# EasyEDA Pro project ProPrj_Multi-Puporse Circuit System Final_2026-03-23.epro, schematic Schematic1
Board Name: Board1; Create Date: 2026-01-26; Page Name: P1; Project Name: Multi-Puporse Circuit System Final; Schematic Name: Schematic1; Update Date: 2026-03-21; Company: EasyEDA.com; Page Size: A4; Version: V1.0
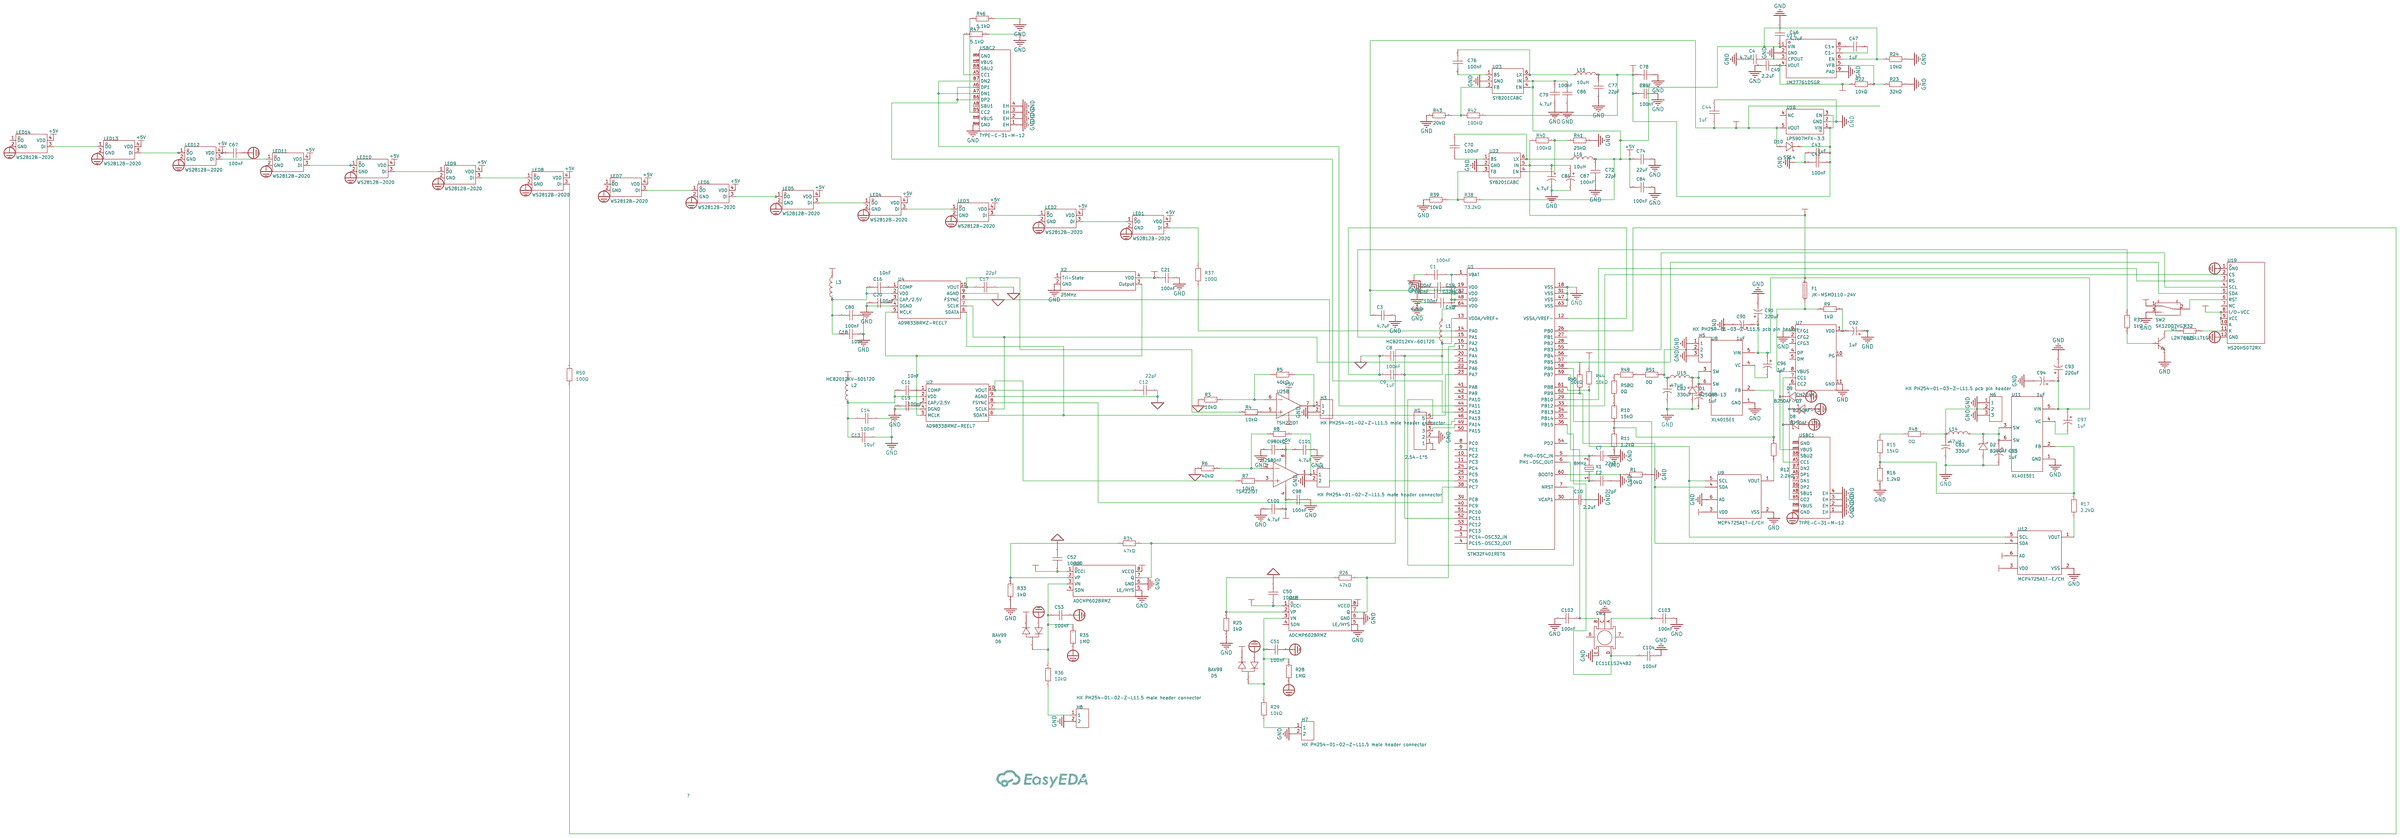
[diagram p0: schematic sheet]

## Parts
C1  100nF  [C0402]
C2  22pF  [C0603]
C3  4.7uF  [C0603]
C4  4.7uF  [C0603]
C7  22pF  [C0603]
C8  100nF  [C0402]
C9  1uF  [C0603]
C10  2.2uF  [C0603]
C11  10nF  [C0603]
C12  22pF  [C0603]
C13  10uF  [C0603]
C14  100nF  [C0402]
C15  100nF  [C0402]
C16  10nF  [C0603]
C17  22pF  [C0603]
C18  10uF  [C0603]
C19  100nF  [C0402]
C20  100nF  [C0402]
C21  100nF  [C0402]
C32MCU  100nF  [C0402]
C42  100nF  [C0402]
C43  1uF  [C0603]
C44  1uF  [C0402]
C46  4.7uF  [C0603]
C47  1uF  [C0603]
C48  100nF  [C0402]
C49  2.2uF  [C0603]
C50  100nF  [C0402]
C51  100nF  [C1206]
C52  100nF  [C0402]
C53  100nF  [C1206]
C67  100nF  [C0402]
C70  100nF  [C0402]
C72  22pF  [C0603]
C74  22uF  [C0603]
C76  100nF  [C0402]
C77  22pF  [C0603]
C78  22uF  [C0603]
C79  4.7uF  [C0603]
C80  100nF  [C0402]
C81  4.7uF  [CAP-SMD_L3.5-W2.8-FD]
C82  330uF  [CAP-TH_BD8.0-P3.50-D0.6-FD]
C83  330uF  [CAP-TH_BD8.0-P3.50-D0.6-FD]
C84  100nF  [C0402]
C85  100nF  [C0402]
C86  100nF  [C0402]
C87  100nF  [C0603]
C88  1uF  [C0603]
C90  1uF  [C0603]
C91  220uF  [CAP-TH_BD8.0-P3.50-D0.6-FD]
C92  1uF  [C0603]
C93  220uF  [CAP-TH_BD8.0-P3.50-D0.6-FD]
C94  1uF  [C0603]
C95  1uF  [C0603]
C96  1uF  [C0603]
C97  1uF  [C0603]
C98  100nF  [C0402]
C99  100nF  [C0402]
C100  4.7uF  [C0603]
C101  4.7uF  [C0603]
C102  100nF  [C0402]
C103  100nF  [C0402]
C104  100nF  [C0402]
D1  B250AF-13  [DO-214AC_L4.3-W2.7-LS5.3-RD]
D2  B250AF-13  [DO-214AC_L4.3-W2.7-LS5.3-RD]
D5  BAV99  [SOT-23-3_L2.9-W1.3-P1.90-LS2.4-BR]
D6  BAV99  [SOT-23-3_L2.9-W1.3-P1.90-LS2.4-BR]
D7  B250AF-13  [DO-214AC_L4.3-W2.7-LS5.3-RD]
D8  B250AF-13  [DO-214AC_L4.3-W2.7-LS5.3-RD]
D9  B250AF-13  [DO-214AC_L4.3-W2.7-LS5.3-RD]
D10  SS14  [SMA_L4.3-W2.6-LS5.1-RD]
F1  JK-MSMD110-24V  [F1812]
H1  2.54-1*5  [HDR-TH_5P-P2.54-V-M]
H3  HX PH254-01-02-Z-L11.5 male header connector  [HDR-TH_2P-P2.54-V-M]
H4  HX PH254-01-02-Z-L11.5 male header connector  [HDR-TH_2P-P2.54-V-M]
H5  HX PH254-01-03-Z-L11.5 pcb pin header  [HDR-TH_3P-P2.54-V-M-1]
H6  HX PH254-01-03-Z-L11.5 pcb pin header  [HDR-TH_3P-P2.54-V-M-1]
H7  HX PH254-01-02-Z-L11.5 male header connector  [HDR-TH_2P-P2.54-V-M]
H8  HX PH254-01-02-Z-L11.5 male header connector  [HDR-TH_2P-P2.54-V-M]
L1  HCB2012KV-601T20  [L0805]
L2  HCB2012KV-601T20  [L0805]
L3  HCB2012KV-601T20  [L0805]
L14  47uH  [IND-SMD_L11.0-W10.2_CXP1050]
L15  10uH  [IND-SMD_L3.0-W3.0]
L16  10uH  [IND-SMD_L3.0-W3.0]
LED1  WS2812B-2020  [LED-SMD_4P-L2.0-W2.0-TL_WS2812B-2020]
LED2  WS2812B-2020  [LED-SMD_4P-L2.0-W2.0-TL_WS2812B-2020]
LED3  WS2812B-2020  [LED-SMD_4P-L2.0-W2.0-TL_WS2812B-2020]
LED4  WS2812B-2020  [LED-SMD_4P-L2.0-W2.0-TL_WS2812B-2020]
LED5  WS2812B-2020  [LED-SMD_4P-L2.0-W2.0-TL_WS2812B-2020]
LED6  WS2812B-2020  [LED-SMD_4P-L2.0-W2.0-TL_WS2812B-2020]
LED7  WS2812B-2020  [LED-SMD_4P-L2.0-W2.0-TL_WS2812B-2020]
LED8  WS2812B-2020  [LED-SMD_4P-L2.0-W2.0-TL_WS2812B-2020]
LED9  WS2812B-2020  [LED-SMD_4P-L2.0-W2.0-TL_WS2812B-2020]
LED10  WS2812B-2020  [LED-SMD_4P-L2.0-W2.0-TL_WS2812B-2020]
LED11  WS2812B-2020  [LED-SMD_4P-L2.0-W2.0-TL_WS2812B-2020]
LED12  WS2812B-2020  [LED-SMD_4P-L2.0-W2.0-TL_WS2812B-2020]
LED13  WS2812B-2020  [LED-SMD_4P-L2.0-W2.0-TL_WS2812B-2020]
LED14  WS2812B-2020  [LED-SMD_4P-L2.0-W2.0-TL_WS2812B-2020]
Q1  L2N7002SLLT1G  [SOT-23-3_L3.0-W1.7-P0.95-LS2.9-BR]
R1  10kΩ  [R0603]
R3  10kΩ  [R0603]
R4  10kΩ  [R0603]
R5  40kΩ  [R0603]
R6  40kΩ  [R0603]
R7  10kΩ  [R0603]
R8  40kΩ  [R0603]
R9  1kΩ  [R0603]
R10  15kΩ  [R0603]
R11  1.2kΩ  [R0603]
R12  2.2kΩ  [R0603]
R15  15kΩ  [R0603]
R16  1.2kΩ  [R0603]
R17  2.2kΩ  [R0603]
R22  10kΩ  [R0603]
R23  32kΩ  [R0603]
R24  10kΩ  [R0603]
R25  1kΩ  [R0603]
R26  47kΩ  [R0603]
R28  1MΩ  [R0603]
R29  10kΩ  [R1206]
R31  1kΩ  [R0603]
R32  10Ω  [R0603]
R33  1kΩ  [R0603]
R34  47kΩ  [R0603]
R35  1MΩ  [R0603]
R36  10kΩ  [R1206]
R37  100Ω  [R0603]
R38  73.2kΩ  [R0603]
R39  10kΩ  [R0603]
R40  100kΩ  [R0402]
R41  25kΩ  [R0805]
R42  100kΩ  [R0402]
R43  20kΩ  [R0402]
R44  10kΩ  [R0603]
R45  10kΩ  [R0603]
R46  5.1kΩ  [R0402]
R47  5.1kΩ  [R0402]
R48  0Ω  [R0603]
R49  0Ω  [R0603]
R50  100Ω  [R0603]
R51  0Ω  [R0603]
R52  0Ω  [R0603]
SW1  EC11E15244B2  [SW-TH_EC11XXXXXXXX]
SW2  SK12D07VG3  [SW-TH_SK12D07VG3]
U1  STM32F401RET6  [LQFP-64_L10.0-W10.0-P0.50-LS12.0-BL]
U2  AD9833BRMZ-REEL7  [MSOP-10_L3.0-W3.0-P0.50-LS5.0-BL]
U4  AD9833BRMZ-REEL7  [MSOP-10_L3.0-W3.0-P0.50-LS5.0-BL]
U7  CH224K  [ESSOP-10_L4.9-W3.9-P1.0-LS6.0-TL-EP]
U8  XL4015E1  [TO-263-5_L10.2-W8.9-P1.70-TL]
U9  MCP4725A1T-E/CH  [SOT-23-6_L2.9-W1.6-P0.95-LS2.8-BR]
U11  XL4015E1  [TO-263-5_L10.2-W8.9-P1.70-TL]
U12  MCP4725A1T-E/CH  [SOT-23-6_L2.9-W1.6-P0.95-LS2.8-BR]
U15  47uH  [IND-SMD_L11.0-W10.2_CXP1050]
U16  LP5907MFX-3.3  [SOT-23-5_L3.0-W1.7-P0.95-LS2.8-BR]
U17  LM27761DSGR  [WSON-8_L2.0-W2.0-P0.65-BL-EP]
U18  ADCMP602BRMZ  [MSOP-8_L3.0-W3.0-P0.65-LS5.0-BL]
U19  HS20HS072RX  [OLED-SMD_HS20HS072RX]
U20  ADCMP602BRMZ  [MSOP-8_L3.0-W3.0-P0.65-LS5.0-BL]
U22  SY8201CABC  [SOT-23-6_L2.9-W1.6-P0.95-LS2.8-BR]
U23  SY8201CABC  [SOT-23-6_L2.9-W1.6-P0.95-LS2.8-BR]
U25  TSH22IDT  [SO-8_L4.9-W3.9-P1.27-LS6.0-BL]  (sections 1,2)
USBC1  TYPE-C-31-M-12  [USB-C_SMD-TYPE-C-31-M-12_1]
USBC2  TYPE-C-31-M-12  [USB-C_SMD-TYPE-C-31-M-12_1]
X1  8MHz  [CRYSTAL-TH_L11.1-W4.7]
X2  25MHz  [OSC-SMD_4P-L3.2-W2.5-BL-OXETDLJANF-0.032768MHZ]

## Library data of the parts
C1 C8 C14 C15 C19-C21 C32MCU C42 C48 C50 C52 C67 C70 C76 C80 C84-C86 C98 C99 C102-C104 = CC0402KRX7R7BB104: Capacitance: Tolerance:±10% Tolerance:±10% Voltage Rated: Temperature Coefficient:; LCSC Part Name: 100nF ±10% 16V; Supplier Part: C60474; Manufacturer: YAGEO(国巨); Supplier Footprint: 0402; JLCPCB Part Class: Extended Part; Datasheet: https://atta.szlcsc.com/upload/public/pdf/source/20211223/9278FD768280B81DDBEF48FA36411A03.pdf; Supplier: LCSC; Tolerance: ±10%
C2 C7 C12 C17 C72 C77 = CC0603JRNPO9BN220: Capacitance:22pF Tolerance:±5% Tolerance:±5% Voltage Rating:50V Temperature Coefficient:NP0; LCSC Part Name: 22pF ±5% 50V; Supplier Part: C105620; Manufacturer: YAGEO(国巨); Supplier Footprint: 0603; JLCPCB Part Class: Extended Part; Datasheet: https://item.szlcsc.com/datasheet/CC0603JRNPO9BN220/106835.html; Supplier: LCSC; Tolerance: ±5%; Voltage Rating: 50V; Temperature Coefficient: NP0
C3 C4 C46 C79 C100 C101 = CL10A475KP8NNNC: Capacitance:4.7uF Tolerance:±10% Tolerance:±10% Voltage Rating:10V Temperature Coefficient:X5R; LCSC Part Name: 4.7uF ±10% 10V; Supplier Part: C1705; Manufacturer: SAMSUNG(三星); Supplier Footprint: 0603; JLCPCB Part Class: Extended Part; Datasheet: https://item.szlcsc.com/datasheet/CL10A475KP8NNNC/2057.html; Supplier: LCSC; Tolerance: ±10%; Voltage Rating: 10V; Temperature Coefficient: X5R
C9 C43 C47 = CL10B105KB8NQNC: Capacitance:1uF Tolerance:±10% Tolerance:±10% Voltage Rating:50V Temperature Coefficient:X7R; LCSC Part Name: 1uF ±10% 50V; Supplier Part: C5199872; Manufacturer: SAMSUNG(三星); Supplier Footprint: 0603; JLCPCB Part Class: Extended Part; Datasheet: https://item.szlcsc.com/datasheet/CL10B105KB8NQNC/5885909.html; Supplier: LCSC; Tolerance: ±10%; Voltage Rating: 50V; Temperature Coefficient: X7R
C10 C49 = CL10A225KO8NNNC: Capacitance:2.2uF Tolerance:±10% Tolerance:±10% Voltage Rating:16V Temperature Coefficient:X5R; LCSC Part Name: 2.2uF ±10% 16V; Supplier Part: C23630; Manufacturer: SAMSUNG(三星); Supplier Footprint: 0603; JLCPCB Part Class: Basic Part; Datasheet: https://item.szlcsc.com/datasheet/CL10A225KO8NNNC/24366.html; Supplier: LCSC; Tolerance: ±10%; Voltage Rating: 16V; Temperature Coefficient: X5R
C11 C16 = FCC0603B103K500CT: Capacitance:10nF Tolerance:±10% Tolerance:±10% Voltage Rating:50V Temperature Coefficient:X7R; LCSC Part Name: 10nF ±10% 50V; Supplier Part: C5137477; Manufacturer: FOJAN(富捷); Supplier Footprint: 0603; JLCPCB Part Class: Extended Part; Datasheet: https://item.szlcsc.com/datasheet/FCC0603B103K500CT/5746979.html; Supplier: LCSC; Tolerance: ±10%; Voltage Rating: 50V; Temperature Coefficient: X7R
C13 C18 = CL10A106MQ8NNNC: Capacitance:10uF Tolerance:±20% Tolerance:±20% Voltage Rating:6.3V Temperature Coefficient:X5R; LCSC Part Name: 10uF ±20% 6.3V; Supplier Part: C1691; Manufacturer: SAMSUNG(三星); Supplier Footprint: 0603; JLCPCB Part Class: Extended Part; Datasheet: https://item.szlcsc.com/datasheet/CL10A106MQ8NNNC/2043.html; Supplier: LCSC; Tolerance: ±20%; Voltage Rating: 6.3V; Temperature Coefficient: X5R
C44 = V105K0402X7R6R3NNT: Capacitance:1uF Voltage Rating:6.3V Temperature Coefficient:X7R; LCSC Part Name: 1uF 6.3V; Supplier Part: C5240378; Manufacturer: VIIYONG(微容); Supplier Footprint: 0402; JLCPCB Part Class: Extended Part; Datasheet: https://item.szlcsc.com/datasheet/V105K0402X7R6R3NNT/5944237.html; Supplier: LCSC; Voltage Rating: 6.3V; Temperature Coefficient: X7R
C51 C53 = CGA1206M3L104J101MT: Capacitance:100nF Tolerance:±5% Tolerance:±5% Voltage Rating:100V Temperature Coefficient:-; LCSC Part Name: 100nF ±5% 100V; Supplier Part: C22440581; Manufacturer: HRE(芯声); Supplier Footprint: 1206; JLCPCB Part Class: Extended Part; Datasheet: https://item.szlcsc.com/datasheet/CGA1206M3L104J101MT/24087515.html; Supplier: LCSC; Tolerance: ±5%; Voltage Rating: 100V
C74 C78 = CL10A226MQ8NRNC: Capacitance:22uF Tolerance:±20% Tolerance:±20% Voltage Rating:6.3V Temperature Coefficient:X5R; LCSC Part Name: 22uF ±20% 6.3V; Supplier Part: C59461; Manufacturer: SAMSUNG(三星); Supplier Footprint: 0603; JLCPCB Part Class: Basic Part; Datasheet: https://item.szlcsc.com/datasheet/CL10A226MQ8NRNC/60514.html; Supplier: LCSC; Tolerance: ±20%; Voltage Rating: 6.3V; Temperature Coefficient: X5R
C81 = CA45-B-35V-4.7UF-K: Capacitance:4.7uF Tolerance:±10% Tolerance:±10% Voltage Rating:35V Current - Leakage:1.6uA Ripple Current:- Equivalent Series Resistance(ESR):- Operating Temperature:-55℃~+125℃ Operating Temperature:-55℃~+125℃; LCSC Part Name: 4.7uF ±10% 35V; Supplier Part: C2764875; Manufacturer: CEC(振华新云); Supplier Footprint: CASE-B-3528-19(mm); JLCPCB Part Class: Extended Part; Datasheet: https://item.szlcsc.com/datasheet/CA45-B-35V-4.7UF-K/2899509.html; Supplier: LCSC; Tolerance: ±10%; Voltage Rating: 35V; Current - Leakage: 1.6uA; Operating Temperature: -55℃~+125℃
C82 C83 = ERS1EM331F12OT: Capacitance: Tolerance:±20% Tolerance:±20% Rated Voltage: Lead Spacing: φD: L: Lifetime @ Temp:7000hrs@105℃; LCSC Part Name: 330uF ±20% 25V; Supplier Part: C383041; Manufacturer: AISHI(艾华集团); Supplier Footprint: 插件,D8xL12mm; JLCPCB Part Class: Extended Part; Datasheet: https://atta.szlcsc.com/upload/public/pdf/source/20191015/C438940_4B8E60A742BB0AE40DDEF87A5C89089D.pdf; Supplier: LCSC; Tolerance: ±20%; Lifetime @ Temp: 7000hrs@105℃
C87 = CC0603KRX7R9BB104: Capacitance:100nF Tolerance:±10% Tolerance:±10% Voltage Rating:50V Temperature Coefficient:X7R; LCSC Part Name: 100nF ±10% 50V; Supplier Part: C14663; Manufacturer: YAGEO(国巨); Supplier Footprint: 0603; JLCPCB Part Class: Basic Part; Datasheet: https://item.szlcsc.com/datasheet/CC0603KRX7R9BB104/15331.html; Supplier: LCSC; Tolerance: ±10%; Voltage Rating: 50V; Temperature Coefficient: X7R
C88 C90 C92 C94-C97 = CL10B105KA8NNNC: Capacitance:1uF Tolerance:±10% Tolerance:±10% Voltage Rating:25V Temperature Coefficient:X7R; LCSC Part Name: 1uF ±10% 25V; Supplier Part: C29936; Manufacturer: SAMSUNG(三星); Supplier Footprint: 0603; JLCPCB Part Class: Extended Part; Datasheet: https://item.szlcsc.com/datasheet/CL10B105KA8NNNC/30690.html; Supplier: LCSC; Tolerance: ±10%; Voltage Rating: 25V; Temperature Coefficient: X7R
C91 C93 = ERS1EM221F12OT: Capacitance:220uF Tolerance:±20% Tolerance:±20% Voltage Rating:25V Pin Spacing:3.5mm Diameter:8mm Height - Seated (Max):12mm Lifetime:7000hrs@105℃; LCSC Part Name: 220uF ±20% 25V; Supplier Part: C160162; Manufacturer: AISHI(艾华集团); Supplier Footprint: 插件,D8xL12mm; JLCPCB Part Class: Extended Part; Datasheet: https://atta.szlcsc.com/upload/public/pdf/source/20191015/C438940_4B8E60A742BB0AE40DDEF87A5C89089D.pdf; Supplier: LCSC; Tolerance: ±20%; Voltage Rating: 25V; Pin Spacing: 3.5mm; Diameter: 8mm; Height - Seated (Max): 12mm; Lifetime: 7000hrs@105℃
D1 D2 D7-D9 = B250AF-13: LCSC Part Name: 2A肖特基势垒整流器; Supplier Part: C17389395; Manufacturer: DIODES(美台); Supplier Footprint: DO-214AC; JLCPCB Part Class: Extended Part; Datasheet: https://item.szlcsc.com/datasheet/B250AF-13/18518568.html; Supplier: LCSC
D5 D6 = BAV99_C51898307: Supplier Part: C51898307; Manufacturer: baocheng(宝乘); Supplier Footprint: SOT-23; JLCPCB Part Class: Extended Part; Datasheet: https://item.szlcsc.com/datasheet/BAV99/54583732.html; Supplier: LCSC
D10 = SS14_C5155166: Voltage - Forward(Vf@If):550mV@1A Voltage - DC Reverse(Vr):40V Current - Rectified:1A Reverse Leakage Current (Ir):500uA Operating Junction Temperature Range:-65℃~+150℃ Operating Junction Temperature Range:-65℃~+150℃ Non-Repetitive Peak Forward Surge Curr; LCSC Part Name: 电压:40V 电流:1A; Supplier Part: C5155166; Manufacturer: SUNMATE(森美特); Supplier Footprint: SMA(DO-214AC); JLCPCB Part Class: Extended Part; Datasheet: https://item.szlcsc.com/datasheet/SS14/5783804.html; Supplier: LCSC; Voltage - Forward(Vf@If): 550mV@1A; Voltage - DC Reverse(Vr): 40V; Current - Rectified: 1A; Reverse Leakage Current (Ir): 500uA; Operating Junction Temperature Range: -65℃~+150℃; Non-Repetitive Peak Forward Surge Current: 40A
F1 = JK-MSMD110-24V: Voltage - Max:24V Current - Max:100A Hold Current:1.1A Trip Current:2.2A Resistance - Initial (Ri) (Min):50mΩ Resistance - Post Trip (R1) (Max):250mΩ Time to Trip(Max):300ms Operating Temperature:-40℃~+85℃ Operating Temperature:-40℃~+85℃ Length:4.73mm Wid; LCSC Part Name: 24V 1.1A 1812自恢复; Supplier Part: C369172; Manufacturer: JK(金科); Supplier Footprint: 1812; JLCPCB Part Class: Extended Part; Datasheet: https://item.szlcsc.com/datasheet/JK-MSMD110-24V/343085.html; Supplier: LCSC; Voltage - Max: 24V; Current - Max: 100A; Hold Current: 1.1A; Trip Current: 2.2A; Resistance - Initial (Ri) (Min): 50mΩ; Resistance - Post Trip (R1) (Max): 250mΩ; Time to Trip(Max): 300ms; Operating Temperature: -40℃~+85℃; Length: 4.73mm; Width: 3.41mm; Height: 1.3mm
H1 = 2.54-1*5: Pin Structure:1x5P Pitch:2.54mm Circluar Pins/Square Pins:Pin Header Mounting Type:Through Hole Number of Rows:1 Number of Pins:5P Current Rating:2.5A Length of Mating Pin:6mm Insulation Height:2.54mm Length of End Connection Pin:3mm Contact Material:Bras; LCSC Part Name: 1x5P 间距:2.54mm 方针 直插; Supplier Part: C5156614; Manufacturer: ZHOURI(洲日); Supplier Footprint: 插件,P=2.54mm; JLCPCB Part Class: Extended Part; Datasheet: https://item.szlcsc.com/datasheet/2.54-1*5/5790714.html; Supplier: LCSC; Pin Structure: 1x5P; Pitch: 2.54mm; Circluar Pins/Square Pins: Pin Header; Mounting Type: Through Hole; Number of Rows: 1; Number of Pins: 5P; Current Rating: 2.5A; Length of Mating Pin: 6mm; Insulation Height: 2.54mm; Length of End Connection Pin: 3mm; Contact Material: Brass; Contact Plating: Gold; Operating Temperature: -40℃~+105℃
H3 H4 H7 H8 = HX PH254-01-02-Z-L11.5 male header connector: Pin Structure:1x2P Pitch:2.54mm Circluar Pins/Square Pins:Pin Header Mounting Type:Through Hole Number of Rows:1 Number of Pins:2P Current Rating:3A Voltage Rating (Max):1kV Length of Mating Pin:6mm Insulation Height:2.5mm Length of End Connection Pin:3mm; LCSC Part Name: 1x2P 间距:2.54mm 方针 直插; Supplier Part: C52016390; Manufacturer: hanxia(韩下); Supplier Footprint: 插件,P=2.54mm; JLCPCB Part Class: Extended Part; Datasheet: https://item.szlcsc.com/datasheet/HX%2520PH254-01-02-Z-L11.5%2520male%2520header%2520connector/54760435.html; Supplier: LCSC; Pin Structure: 1x2P; Pitch: 2.54mm; Circluar Pins/Square Pins: Pin Header; Mounting Type: Through Hole; Number of Rows: 1; Number of Pins: 2P; Current Rating: 3A; Voltage Rating (Max): 1kV; Length of Mating Pin: 6mm; Insulation Height: 2.5mm; Length of End Connection Pin: 3mm; Contact Material: Brass; Contact Plating: Gold; Operating Temperature: -40℃~+105℃
H5 H6 = HX PH254-01-03-Z-L11.5 pcb pin header: Pin Structure:1x3P Pitch:2.54mm Circluar Pins/Square Pins:Pin Header Mounting Type:Through Hole Number of Rows:1 Number of Pins:3P Current Rating:3A Voltage Rating (Max):1kV Length of Mating Pin:6mm Insulation Height:2.5mm Length of End Connection Pin:3mm; LCSC Part Name: 1x3P 间距:2.54mm 方针 直插; Supplier Part: C52016391; Manufacturer: hanxia(韩下); Supplier Footprint: 插件,P=2.54mm; JLCPCB Part Class: Extended Part; Datasheet: https://item.szlcsc.com/datasheet/HX%2520PH254-01-03-Z-L11.5%2520pcb%2520pin%2520header/54760436.html; Supplier: LCSC; Pin Structure: 1x3P; Pitch: 2.54mm; Circluar Pins/Square Pins: Pin Header; Mounting Type: Through Hole; Number of Rows: 1; Number of Pins: 3P; Current Rating: 3A; Voltage Rating (Max): 1kV; Length of Mating Pin: 6mm; Insulation Height: 2.5mm; Length of End Connection Pin: 3mm; Contact Material: Brass; Contact Plating: Gold; Operating Temperature: -40℃~+105℃
L1-L3 = HCB2012KV-601T20: Impedance @ Frequency:600Ω Tolerance:±25% Tolerance:±25%; LCSC Part Name: 车载品-2mm*1.2mm-600?-±25%; Supplier Part: C5139902; Manufacturer: TAI-TECH(台庆); Supplier Footprint: 0805; JLCPCB Part Class: Extended Part; Supplier: LCSC; Impedance @ Frequency: 600Ω; Tolerance: ±25%
L14 U15 = CXP1050-470M-AG(47uh): Inductance:47uH Tolerance:±20% Tolerance:±20% Saturation Current (Isat):5A Type:Integrated molded inductor; LCSC Part Name: 47uH ±20% 5A; Supplier Part: C7187330; Manufacturer: DMBJ(振宝佳); Supplier Footprint: SMD,10.2x11mm; JLCPCB Part Class: Extended Part; Datasheet: https://atta.szlcsc.com/upload/public/pdf/source/20230710/CFC2BBD551035D908F0C7CBC8304138F.pdf; Supplier: LCSC; Tolerance: ±20%; Saturation Current (Isat): 5A; Type: Integrated molded inductor
L15 L16 = ZET-CORE-303012DT100MBCA: Inductance:10uH Tolerance:±20% Tolerance:±20% Current Rating:2.5A Current - Saturation(Isat):2.5A DC Resistance(DCR):192mΩ Type:Molded Inductor; LCSC Part Name: 10uH ±20% 2.5A; Supplier Part: C49009156; Manufacturer: ZE(增益); Supplier Footprint: SMD,3x3mm; JLCPCB Part Class: Extended Part; Datasheet: https://item.szlcsc.com/datasheet/ZET-CORE-303012DT100MBCA/51362276.html; Supplier: LCSC; Tolerance: ±20%; Current Rating: 2.5A; Current - Saturation(Isat): 2.5A; DC Resistance(DCR): 192mΩ; Type: Molded Inductor
LED1-LED14 = WS2812B-2020: Wavelength:515.6nm；622.5nm；470.4nm Luminous Intensity:200mcd；160mcd；520mcd Fixed-Frequency Pwm Mode:- Data Transmission Rate:100KB/S Voltage - Supply:5V Voltage - Supply:5V Quiescent Current:- Lens Color:- ESD Withstand Voltage:- Installation method:op Vi; LCSC Part Name: RGB三色; Supplier Part: C965555; Manufacturer: worldsemi; Supplier Footprint: SMD,2.2x2mm; JLCPCB Part Class: Extended Part; Datasheet: https://item.szlcsc.com/datasheet/WS2812B-2020/1051115.html; Supplier: LCSC; Wavelength: 515.6nm；622.5nm；470.4nm; Luminous Intensity: 200mcd；160mcd；520mcd; Data Transmission Rate: 100KB/S; Voltage - Supply: 5V; Installation method: op View Mount
Q1 = L2N7002SLLT1G: Type:1 N-channel Drain to Source Voltage:60V Current - Continuous Drain(Id): RDS(on):2.8Ω@10V,500mA Pd - Power Dissipation:300mW Gate Threshold Voltage (Vgs(th)@Id):- Gate Charge(Qg):440pC@4.5V Input Capacitance(Ciss@Vds):35pF@25V Reverse Transfer Capacit; LCSC Part Name: 1个N沟道 耐压:60V 电流:380mA; Supplier Part: C22446827; Manufacturer: LRC(乐山无线电); Supplier Footprint: SOT-23; JLCPCB Part Class: Extended Part; Datasheet: https://atta.szlcsc.com/upload/public/pdf/source/20240529/804683F6F610BC810C43B61F364F3FCA.pdf; Supplier: LCSC; Type: 1 N-channel; Drain to Source Voltage: 60V; RDS(on): 2.8Ω@10V,500mA; Pd - Power Dissipation: 300mW; Gate Charge(Qg): 440pC@4.5V; Input Capacitance(Ciss@Vds): 35pF@25V; Operating Temperature: -55℃~+150℃
R1 R3 R4 R7 R22 R24 R39 R44 R45 = RC0603FR-0710KL: Type:Thick Film Resistors Resistance: Tolerance:±1% Tolerance:±1% Power(Watts): Overload Voltage (Max): Temperature Coefficient:±100ppm/℃ Temperature Coefficient:±100ppm/℃ Operating Temperature Range:-55℃~+155℃ Operating Temperature Range:-55℃~+155℃; LCSC Part Name: 厚膜电阻 10kΩ ±1% 100mW; Supplier Part: C98220; Manufacturer: YAGEO(国巨); Supplier Footprint: 0603; JLCPCB Part Class: Extended Part; Datasheet: https://atta.szlcsc.com/upload/public/pdf/source/20180927/C295883_E8D83085EA81BD7DE0B2B681138C15EE.pdf; Supplier: LCSC; Type: Thick Film Resistors; Tolerance: ±1%; Temperature Coefficient: ±100ppm/℃; Operating Temperature Range: -55℃~+155℃
R5 R6 R8 = SCR0603F40K: Type:Thick Film Resistors Resistance: Tolerance:±1% Tolerance:±1% Power(Watts): Overload Voltage (Max): Operating Temperature Range:-55℃~+155℃ Operating Temperature Range:-55℃~+155℃; LCSC Part Name: 40kΩ ±1%; Supplier Part: C3016445; Manufacturer: VO(翔胜); Supplier Footprint: 0603; JLCPCB Part Class: Extended Part; Datasheet: https://atta.szlcsc.com/upload/public/pdf/source/20220513/247AF9639BA21CF93567DC289CCC6A22.pdf; Supplier: LCSC; Type: Thick Film Resistors; Tolerance: ±1%; Operating Temperature Range: -55℃~+155℃
R9 R25 R31 R33 = 0603WAF1001T5E: Type:Thick Film Resistor Resistance:1kΩ Tolerance:±1% Tolerance:±1% Power(Watts):100mW Voltage-Supply(Max):75V Temperature Coefficient:±100ppm/℃ Temperature Coefficient:±100ppm/℃ Operating Temperature:-55℃~+155℃ Operating Temperature:-55℃~+155℃; LCSC Part Name: 1kΩ ±1% 100mW 厚膜电阻; Supplier Part: C21190; Manufacturer: UNI-ROYAL(厚声); Supplier Footprint: 0603; JLCPCB Part Class: Basic Part; Datasheet: https://item.szlcsc.com/datasheet/0603WAF1001T5E/21904.html; Supplier: LCSC; Type: Thick Film Resistor; Tolerance: ±1%; Power(Watts): 100mW; Voltage-Supply(Max): 75V; Temperature Coefficient: ±100ppm/℃; Operating Temperature: -55℃~+155℃
R10 R15 = 0603WAF1502T5E: Type:Thick Film Resistor Resistance:15kΩ Tolerance:±1% Tolerance:±1% Power(Watts):100mW Voltage-Supply(Max):75V Temperature Coefficient:±100ppm/℃ Temperature Coefficient:±100ppm/℃ Operating Temperature:-55℃~+155℃ Operating Temperature:-55℃~+155℃; LCSC Part Name: 15kΩ ±1% 100mW 厚膜电阻; Supplier Part: C22809; Manufacturer: UNI-ROYAL(厚声); Supplier Footprint: 0603; JLCPCB Part Class: Basic Part; Datasheet: https://item.szlcsc.com/datasheet/0603WAF1502T5E/23536.html; Supplier: LCSC; Type: Thick Film Resistor; Tolerance: ±1%; Power(Watts): 100mW; Voltage-Supply(Max): 75V; Temperature Coefficient: ±100ppm/℃; Operating Temperature: -55℃~+155℃
R11 R16 = 0603WAF1201T5E: Type:Thick Film Resistor Resistance:1.2kΩ Tolerance:±1% Tolerance:±1% Power(Watts):100mW Voltage-Supply(Max):75V Temperature Coefficient:±100ppm/℃ Temperature Coefficient:±100ppm/℃ Operating Temperature:-55℃~+155℃ Operating Temperature:-55℃~+155℃; LCSC Part Name: 1.2kΩ ±1% 100mW 厚膜电阻; Supplier Part: C22765; Manufacturer: UNI-ROYAL(厚声); Supplier Footprint: 0603; JLCPCB Part Class: Basic Part; Datasheet: https://item.szlcsc.com/datasheet/0603WAF1201T5E/23492.html; Supplier: LCSC; Type: Thick Film Resistor; Tolerance: ±1%; Power(Watts): 100mW; Voltage-Supply(Max): 75V; Temperature Coefficient: ±100ppm/℃; Operating Temperature: -55℃~+155℃
R12 R17 = 0603WAF2201T5E_C4190: Type:Thick Film Resistors Resistance:2.2kΩ Tolerance:±1% Tolerance:±1% Power(Watts): Overload Voltage (Max): Temperature Coefficient:±100ppm/℃ Temperature Coefficient:±100ppm/℃ Operating Temperature Range:-55℃~+155℃ Operating Temperature Range:-55℃~+155℃; LCSC Part Name: 2.2kΩ ±1% 100mW 厚膜电阻; Supplier Part: C4190; Manufacturer: UNI-ROYAL(厚声); Manufacturer Part: 0603WAF2201T5E; Supplier Footprint: 0603; JLCPCB Part Class: Basic Part; Datasheet: https://atta.szlcsc.com/upload/public/pdf/source/20200306/C422600_1E6D84923E4A46A82E41ADD87F860B5C.pdf; Supplier: LCSC; Type: Thick Film Resistors; Tolerance: ±1%; Temperature Coefficient: ±100ppm/℃; Operating Temperature Range: -55℃~+155℃
R23 = AR03BTC3202: Resistance:32kΩ Tolerance:±0.1% Tolerance:±0.1% Power(Watts):62.5mW Temperature Coefficient:±25ppm/℃ Temperature Coefficient:±25ppm/℃; LCSC Part Name: 32kΩ ±0.1% 62.5mW; Supplier Part: C304066; Manufacturer: Viking(光颉); Supplier Footprint: 0603; JLCPCB Part Class: Extended Part; Datasheet: https://item.szlcsc.com/datasheet/AR03BTC3202/288133.html; Supplier: LCSC; Tolerance: ±0.1%; Power(Watts): 62.5mW; Temperature Coefficient: ±25ppm/℃
R26 R34 = 0603WAF4702T5E: Type:Thick Film Resistor Resistance:47kΩ Tolerance:±1% Tolerance:±1% Power(Watts):100mW Voltage-Supply(Max):75V Temperature Coefficient:±100ppm/℃ Temperature Coefficient:±100ppm/℃ Operating Temperature:-55℃~+155℃ Operating Temperature:-55℃~+155℃; LCSC Part Name: 47kΩ ±1% 100mW 厚膜电阻; Supplier Part: C25819; Manufacturer: UNI-ROYAL(厚声); Supplier Footprint: 0603; JLCPCB Part Class: Basic Part; Datasheet: https://item.szlcsc.com/datasheet/0603WAF4702T5E/26562.html; Supplier: LCSC; Type: Thick Film Resistor; Tolerance: ±1%; Power(Watts): 100mW; Voltage-Supply(Max): 75V; Temperature Coefficient: ±100ppm/℃; Operating Temperature: -55℃~+155℃
R28 R35 = 0603WAF1004T5E: Type:Thick Film Resistors Resistance:1MΩ Tolerance:±1% Tolerance:±1% Power(Watts): Overload Voltage (Max): Temperature Coefficient:±100ppm/℃ Temperature Coefficient:±100ppm/℃ Operating Temperature Range:-55℃~+155℃ Operating Temperature Range:-55℃~+155℃; LCSC Part Name: 1MΩ ±1% 100mW 厚膜电阻; Supplier Part: C22935; Manufacturer: UNI-ROYAL(厚声); Supplier Footprint: 0603; JLCPCB Part Class: Basic Part; Datasheet: https://atta.szlcsc.com/upload/public/pdf/source/20200306/C422600_1E6D84923E4A46A82E41ADD87F860B5C.pdf; Supplier: LCSC; Type: Thick Film Resistors; Tolerance: ±1%; Temperature Coefficient: ±100ppm/℃; Operating Temperature Range: -55℃~+155℃
R29 R36 = 1206W4F1002T5E: Type:Thick Film Resistor Resistance:10kΩ Tolerance:±1% Tolerance:±1% Power(Watts):250mW Voltage-Supply(Max):200V Temperature Coefficient:±100ppm/℃ Temperature Coefficient:±100ppm/℃ Operating Temperature:-55℃~+155℃ Operating Temperature:-55℃~+155℃; LCSC Part Name: 10kΩ ±1% 250mW 厚膜电阻; Supplier Part: C17902; Manufacturer: UNI-ROYAL(厚声); Supplier Footprint: 1206; JLCPCB Part Class: Basic Part; Datasheet: https://item.szlcsc.com/datasheet/1206W4F1002T5E/18590.html; Supplier: LCSC; Type: Thick Film Resistor; Tolerance: ±1%; Power(Watts): 250mW; Voltage-Supply(Max): 200V; Temperature Coefficient: ±100ppm/℃; Operating Temperature: -55℃~+155℃
R32 = 0603WAF100JT5E: Type:Thick Film Resistor Resistance:10Ω Tolerance:±1% Tolerance:±1% Power(Watts):100mW Voltage-Supply(Max):75V Temperature Coefficient:±400ppm/℃ Temperature Coefficient:±400ppm/℃ Operating Temperature:-55℃~+155℃ Operating Temperature:-55℃~+155℃; LCSC Part Name: 10Ω ±1% 100mW 厚膜电阻; Supplier Part: C22859; Manufacturer: UNI-ROYAL(厚声); Supplier Footprint: 0603; JLCPCB Part Class: Basic Part; Datasheet: https://item.szlcsc.com/datasheet/0603WAF100JT5E/23586.html; Supplier: LCSC; Type: Thick Film Resistor; Tolerance: ±1%; Power(Watts): 100mW; Voltage-Supply(Max): 75V; Temperature Coefficient: ±400ppm/℃; Operating Temperature: -55℃~+155℃
R37 R50 = FRC0603J101 TS: Type:Thick Film Resistor Resistance:100Ω Tolerance:±5% Tolerance:±5% Power(Watts):100mW Voltage-Supply(Max):75V Temperature Coefficient:±100ppm/℃ Temperature Coefficient:±100ppm/℃ Operating Temperature:-55℃~+155℃ Operating Temperature:-55℃~+155℃; LCSC Part Name: 100Ω ±5% 100mW 厚膜电阻; Supplier Part: C2907089; Manufacturer: FOJAN(富捷); Supplier Footprint: 0603; JLCPCB Part Class: Extended Part; Supplier: LCSC; Type: Thick Film Resistor; Tolerance: ±5%; Power(Watts): 100mW; Voltage-Supply(Max): 75V; Temperature Coefficient: ±100ppm/℃; Operating Temperature: -55℃~+155℃
R38 = RS-03K7322FT: Type:Thick Film Resistors Resistance:73.2kΩ Tolerance:±1% Tolerance:±1% Power(Watts): Overload Voltage (Max): Temperature Coefficient:±100ppm/℃ Temperature Coefficient:±100ppm/℃ Operating Temperature Range:-55℃~+155℃ Operating Temperature Range:-55℃~+155℃; LCSC Part Name: 厚膜电阻 73.2kΩ ±1% 100mW; Supplier Part: C321992; Manufacturer: FH(风华); Supplier Footprint: 0603; JLCPCB Part Class: Extended Part; Datasheet: https://atta.szlcsc.com/upload/public/pdf/source/20190505/C118335_36085569433BA7FFC796E569DBFE3139.pdf; Supplier: LCSC; Type: Thick Film Resistors; Tolerance: ±1%; Temperature Coefficient: ±100ppm/℃; Operating Temperature Range: -55℃~+155℃
R40 R42 = RC0402FR-07100KL: Type:Thick Film Resistor Resistance:100kΩ Tolerance:±1% Tolerance:±1% Power(Watts):62.5mW Voltage-Supply(Max):50V Temperature Coefficient:±100ppm/℃ Temperature Coefficient:±100ppm/℃ Operating Temperature:-55℃~+155℃ Operating Temperature:-55℃~+155℃; LCSC Part Name: 厚膜电阻 100kΩ ±1% 62.5mW; Supplier Part: C60491; Manufacturer: YAGEO(国巨); Supplier Footprint: 0402; JLCPCB Part Class: Extended Part; Datasheet: https://item.szlcsc.com/datasheet/RC0402FR-07100KL/61543.html; Supplier: LCSC; Type: Thick Film Resistor; Tolerance: ±1%; Power(Watts): 62.5mW; Voltage-Supply(Max): 50V; Temperature Coefficient: ±100ppm/℃; Operating Temperature: -55℃~+155℃
R41 = ARG05DTC2502: Type:Thin Film Resistor Resistance:25kΩ Tolerance:±0.5% Tolerance:±0.5% Power(Watts):125mW Voltage-Supply(Max):150V Temperature Coefficient:±25ppm/℃ Temperature Coefficient:±25ppm/℃ Operating Temperature:-55℃~+155℃ Operating Temperature:-55℃~+155℃; LCSC Part Name: 薄膜电阻 25kΩ ±0.5% 125mW; Supplier Part: C2828838; Manufacturer: Viking(光颉); Supplier Footprint: 0805; JLCPCB Part Class: Extended Part; Datasheet: https://item.szlcsc.com/datasheet/ARG05DTC2502/2977307.html; Supplier: LCSC; Type: Thin Film Resistor; Tolerance: ±0.5%; Power(Watts): 125mW; Voltage-Supply(Max): 150V; Temperature Coefficient: ±25ppm/℃; Operating Temperature: -55℃~+155℃
R43 = RC0402FR-0720KL: Type:Thick Film Resistor Resistance:20kΩ Tolerance:±1% Tolerance:±1% Power(Watts):62.5mW Voltage-Supply(Max):50V Temperature Coefficient:±100ppm/℃ Temperature Coefficient:±100ppm/℃ Operating Temperature:-55℃~+155℃ Operating Temperature:-55℃~+155℃; LCSC Part Name: 厚膜电阻 20kΩ ±1% 62.5mW; Supplier Part: C93942; Manufacturer: YAGEO(国巨); Supplier Footprint: 0402; JLCPCB Part Class: Extended Part; Datasheet: https://item.szlcsc.com/datasheet/RC0402FR-0720KL/95140.html; Supplier: LCSC; Type: Thick Film Resistor; Tolerance: ±1%; Power(Watts): 62.5mW; Voltage-Supply(Max): 50V; Temperature Coefficient: ±100ppm/℃; Operating Temperature: -55℃~+155℃
R46 R47 = FRC0402F5101TS: Type:Thick Film Resistor Resistance:5.1kΩ Tolerance:±1% Tolerance:±1% Power(Watts):62.5mW Voltage-Supply(Max):50V Temperature Coefficient:±100ppm/℃ Temperature Coefficient:±100ppm/℃ Operating Temperature:-55℃~+155℃ Operating Temperature:-55℃~+155℃; LCSC Part Name: 5.1kΩ ±1% 62.5mW 厚膜电阻; Supplier Part: C2906874; Manufacturer: FOJAN(富捷); Supplier Footprint: 0402; JLCPCB Part Class: Extended Part; Supplier: LCSC; Type: Thick Film Resistor; Tolerance: ±1%; Power(Watts): 62.5mW; Voltage-Supply(Max): 50V; Temperature Coefficient: ±100ppm/℃; Operating Temperature: -55℃~+155℃
R48 R49 R51 R52 = FRC0603P000 TS: Type:Thick Film Resistor Resistance:0Ω Tolerance:±5% Tolerance:±5% Power(Watts):100mW Voltage-Supply(Max):75V Operating Temperature:-55℃~+155℃ Operating Temperature:-55℃~+155℃; LCSC Part Name: 0Ω ±5% 100mW 厚膜电阻; Supplier Part: C2907080; Manufacturer: FOJAN(富捷); Supplier Footprint: 0603; JLCPCB Part Class: Extended Part; Supplier: LCSC; Type: Thick Film Resistor; Tolerance: ±5%; Power(Watts): 100mW; Voltage-Supply(Max): 75V; Operating Temperature: -55℃~+155℃
SW1 = EC11E15244B2_C470754: Supplier Part: C470754; Manufacturer: ALPSALPINE(阿尔卑斯阿尔派); Supplier Footprint: 插件; JLCPCB Part Class: Extended Part; Datasheet: https://atta.szlcsc.com/upload/public/pdf/source/20191216/C470795_DE763ECE59BD49533DB26DB53E5D34B2.pdf; Supplier: LCSC
SW2 = SK12D07VG3_C431547: Circuit:SPDT Actuator Style:- Termination Style:PC Pin Length:8.7mm Width:4.4mm Switch Height:4.7mm Mounting Type:- Actuator Color:- Current Rating:500mA Voltage Rating:50V Life:5,000 cycles Operating Temperature:-10℃~+50℃ Operating Temperature:-10℃~+50℃; Supplier Part: C431547; Manufacturer: SHOU HAN(首韩); Supplier Footprint: 插件,8.7x4.4mm; JLCPCB Part Class: Extended Part; Datasheet: https://item.szlcsc.com/datasheet/SK12D07VG3/427904.html; Supplier: LCSC; Circuit: SPDT; Termination Style: PC Pin; Length: 8.7mm; Width: 4.4mm; Switch Height: 4.7mm; Current Rating: 500mA; Voltage Rating: 50V; Life: 5,000 cycles; Operating Temperature: -10℃~+50℃
U1 = STM32F401RET6: CPU Core:ARM-M4 CPU Maximum Speed:84MHz Program Storage Size:512KB Number of I/O:50 ADC (Bit):12bit Voltage - Supply:1.7V~3.6V Voltage - Supply:1.7V~3.6V Applications:-; LCSC Part Name: 带DSP和FPU的STM32动态效率ARM Cortex-M4 MCU，具有最大512 KB Flash、84 MHz CPU和ART加速器; Supplier Part: C116978; Manufacturer: ST(意法半导体); Supplier Footprint: LQFP-64(10x10); JLCPCB Part Class: Extended Part; Datasheet: https://item.szlcsc.com/datasheet/STM32F401RET6/118236.html; Supplier: LCSC; CPU Core: ARM-M4; CPU Maximum Speed: 84MHz; Program Storage Size: 512KB; Number of I/O: 50; ADC (Bit): 12bit; Voltage - Supply: 1.7V~3.6V
U2 U4 = AD9833BRMZ-REEL7: Voltage - Supply:2.3V~5.5V Voltage - Supply:2.3V~5.5V Resolution (Bits):10 Tuning Word Width(Bits):28b The main FCLK:25MHz Operating Temperature:-40℃~+85℃ Operating Temperature:-40℃~+85℃; LCSC Part Name: AD9833低功耗DDS设备; Supplier Part: C9652; Manufacturer: ADI(亚德诺); Supplier Footprint: MSOP-10; JLCPCB Part Class: Extended Part; Datasheet: https://item.szlcsc.com/datasheet/AD9833BRMZ-REEL7/10182.html; Supplier: LCSC; Voltage - Supply: 2.3V~5.5V; Resolution (Bits): 10; Tuning Word Width(Bits): 28b; The main FCLK: 25MHz; Operating Temperature: -40℃~+85℃
U7 = CH224K: Type:Power Receiver Controller Protocol:- Number of Channels:- Output Power:100W Output Voltage:5V；20V；15V；12V；9V Voltage - Supply:- Voltage - Supply:- Operating Temperature:-40℃~+90℃ Operating Temperature:-40℃~+90℃; LCSC Part Name: USBPD等多快充协议受电芯片CH224; Supplier Part: C970725; Manufacturer: WCH(南京沁恒); Supplier Footprint: ESSOP-10-150mil-1mm; JLCPCB Part Class: Extended Part; Datasheet: https://item.szlcsc.com/datasheet/CH224K/1060460.html; Supplier: LCSC; Type: Power Receiver Controller; Output Power: 100W; Output Voltage: 5V；20V；15V；12V；9V; Operating Temperature: -40℃~+90℃
U8 U11 = XL4015E1: Function:Buck Voltage - Supply:8V~36V Voltage - Supply:8V~36V Output Voltage:1.25V~32V Output Voltage:1.25V~32V Output Current:5A Frequency - Switching:180kHz Frequency - Switching:180kHz Operating Temperature:-40℃~+125℃ Operating Temperature:-40℃~+125℃ S; LCSC Part Name: 5A 180KHz 36V 降压型DC-DC转换器; Supplier Part: C51661; Manufacturer: XLSEMI(芯龙); Supplier Footprint: TO-263-5; JLCPCB Part Class: Extended Part; Datasheet: https://item.szlcsc.com/datasheet/XL4015E1/52674.html; Supplier: LCSC; Function: Buck; Voltage - Supply: 8V~36V; Output Voltage: 1.25V~32V; Output Current: 5A; Frequency - Switching: 180kHz; Operating Temperature: -40℃~+125℃; Synchronous Rectifier: No; Number of Outputs: 1; Topology: Buck; Quiescent Current: 5mA; Switch tube (built-in/external): Built-in; Output Type: Adjustable
U9 U12 = MCP4725A1T-E/CH: Resolution(Bits):12 Number of Channels:1 Interface:I2C Voltage - Supply:2.7V~5.5V Voltage - Supply:2.7V~5.5V Settling Time:6us Output Type:Voltage Buffer Integral non - linearity:2LSB Integral non - linearity:2LSB Operating Temperature:-40℃~+125℃ Operatin; LCSC Part Name: 12-位数字到模拟转换器带EEPROM内存，采用SOT-23-6封装; Supplier Part: C61423; Manufacturer: MICROCHIP(美国微芯); Supplier Footprint: SOT-23-6; JLCPCB Part Class: Extended Part; Datasheet: https://item.szlcsc.com/datasheet/MCP4725A1T-E%252FCH/62476.html; Supplier: LCSC; Resolution(Bits): 12; Number of Channels: 1; Interface: I2C; Voltage - Supply: 2.7V~5.5V; Settling Time: 6us; Output Type: Voltage Buffer; Integral non - linearity: 2LSB; Operating Temperature: -40℃~+125℃; Power-On Reset: Built-in; Voltage Reference: External; Data rate: 3.4MHz；100kHz；400kHz; Quiescent Current (Iq): 60nA
U16 = LP5907MFX-3.3: Output Type:Fixed Voltage - Supply:5.5V Output Voltage:3.3V Output Voltage:3.3V Output Current:300mA Power Supply Rejection Ratio (PSRR):75dB@(1kHz) Voltage Dropout:180mV@(300mA) standby current:2uA Noise:51uVrms Features:Over Current Protection；Enable；Ov; LCSC Part Name: 集成电路; Supplier Part: C23380874; Manufacturer: TECH PUBLIC(台舟); Supplier Footprint: SOT-23-5; JLCPCB Part Class: Extended Part; Datasheet: https://item.szlcsc.com/datasheet/LP5907MFX-3.3/25111544.html; Supplier: LCSC; Output Type: Fixed; Voltage - Supply: 5.5V; Output Voltage: 3.3V; Output Current: 300mA; Power Supply Rejection Ratio (PSRR): 75dB@(1kHz); Voltage Dropout: 180mV@(300mA); standby current: 2uA; Noise: 51uVrms; Features: Over Current Protection；Enable；Over Temperature Protection; Operating Temperature: -40℃~+150℃; Output Configuration: Positive; Number of Outputs: 1
U17 = LM27761DSGR: LCSC Part Name: 具有集成 LDO 的低噪声稳压逆变器; Supplier Part: C129351; Manufacturer: TI(德州仪器); Supplier Footprint: WFDFN-8-EP(2x2); JLCPCB Part Class: Extended Part; Datasheet: https://www.ti.com/cn/lit/gpn/lm27761; Supplier: LCSC
U18 U20 = ADCMP602BRMZ: Number of Channels:Single channel Vos - Input Offset Voltage:5mV Ib - Input Bias Current:5uA Propagation Delay Time:3.5ns Input Hysteresis Voltage (Vhys):- Common Mode Rejection Ratio(CMRR):- Voltage - Supply:2.5V~5.5V Voltage - Supply:2.5V~5.5V Output Ty; LCSC Part Name: 轨到轨、快速、2.5 V至5.5 V单电源TTL/CMOS比较器; Supplier Part: C207991; Manufacturer: ADI(亚德诺); Supplier Footprint: MSOP-8; JLCPCB Part Class: Extended Part; Datasheet: https://item.szlcsc.com/datasheet/ADCMP602BRMZ/209045.html; Supplier: LCSC; Number of Channels: Single channel; Vos - Input Offset Voltage: 5mV; Ib - Input Bias Current: 5uA; Propagation Delay Time: 3.5ns; Voltage - Supply: 2.5V~5.5V; Output Type: CMOS；TTL; Rail to Rail: Rail-to-rail input, Rail-to-rail output; Quiescent Current per Amplifier: 3.5mA; Operating Temperature: -40℃~+125℃
U19 = HS20HS072RX: Controller Type:ST7789 Size:2 Dot Pixels:320x240 Operating Temperature:-20℃~+70℃ Operating Temperature:-20℃~+70℃; LCSC Part Name: 2.0寸240*320(RGB)彩色SPI串口TFT液晶显示屏; Supplier Part: C5329582; Manufacturer: HS(汉昇); JLCPCB Part Class: Extended Part; Datasheet: https://atta.szlcsc.com/upload/public/pdf/source/20221215/8081666AF7BFDE257CAA474692F2FEBB.pdf; Supplier: LCSC; Controller Type: ST7789; Size: 2; Dot Pixels: 320x240; Operating Temperature: -20℃~+70℃
U22 U23 = SY8201CABC: Function:Buck Voltage - Supply:4.5V~27V Voltage - Supply:4.5V~27V Output Voltage:1.2V Output Voltage:1.2V Output Current:1A Frequency - Switching:1.15MHz Frequency - Switching:1.15MHz Operating Temperature:-40℃~+85℃ Operating Temperature:-40℃~+85℃ Synchro; LCSC Part Name: 高效率快速响应1A 27V输入同步降压调节器; Supplier Part: C2763455; Manufacturer: Silergy(矽力杰); Supplier Footprint: SOT-23-6; JLCPCB Part Class: Extended Part; Datasheet: https://item.szlcsc.com/datasheet/SY8201CABC/2893333.html; Supplier: LCSC; Function: Buck; Voltage - Supply: 4.5V~27V; Output Voltage: 1.2V; Output Current: 1A; Frequency - Switching: 1.15MHz; Operating Temperature: -40℃~+85℃; Synchronous Rectifier: Yes; Number of Outputs: 1; Topology: Buck; Quiescent Current: 400uA; Switch tube (built-in/external): Built-in; Output Type: Fixed
U25 = TSH22IDT: Number of Channels:2 Maximum Power Supply Range (Vdd-Vss):36V Rail to Rail:- Gain Bandwidth Product:25MHz Vos - Input Offset Voltage:2.5mV Input Offset Voltage Drift(Vos TC):2uV/℃ Slew Rate:15V/us Ib - Input Bias Current:650nA Input Offset Current(Ios):65; LCSC Part Name: 高增益带宽积双极性运算放大器; Supplier Part: C87720; Manufacturer: ST(意法半导体); Supplier Footprint: SO-8; JLCPCB Part Class: Extended Part; Datasheet: https://item.szlcsc.com/datasheet/TSH22IDT/88898.html; Supplier: LCSC; Number of Channels: 2; Maximum Power Supply Range (Vdd-Vss): 36V; Gain Bandwidth Product: 25MHz; Vos - Input Offset Voltage: 2.5mV; Input Offset Voltage Drift(Vos TC): 2uV/℃; Slew Rate: 15V/us; Ib - Input Bias Current: 650nA; Input Offset Current(Ios): 65nA; Noise density(eN): 14nV/√Hz@1kHz; Common Mode Rejection Ratio(CMRR): 100dB; Quiescent Current: 2.15mA; Output Current: 37mA; Operating Temperature: -40℃~+125℃; Single supply: 3V~30V; Dual Supply: -1.5V~15V
USBC1 USBC2 = TYPE-C-31-M-12: Connector Type:Type-C Protocol Standard:- Gender:Female Mounting Type:Surface Mount, Right Angle Number of Contacts:16P Number of Ports:1 Current Rating-Power:5A Voltage Rating:20V Connect-Disconnect Life:10,000 cycles Length:7.35mm Operating Temperature:; LCSC Part Name: Type-C 母 卧贴; Supplier Part: C165948; Manufacturer: 韩国韩荣; Supplier Footprint: SMD; JLCPCB Part Class: Extended Part; Datasheet: https://item.szlcsc.com/datasheet/TYPE-C-31-M-12/177331.html; Supplier: LCSC; Connector Type: Type-C; Gender: Female; Mounting Type: Surface Mount, Right Angle; Number of Contacts: 16P; Number of Ports: 1; Current Rating-Power: 5A; Voltage Rating: 20V; Connect-Disconnect Life: 10,000 cycles; Length: 7.35mm; Operating Temperature: -30℃~+80℃
X1 = T49S8MLDBE2X: Type:Through Hole Crystal Oscillator Frequency:8MHz Normal temperature Frequency Tolerance:±20ppm Normal temperature Frequency Tolerance:±20ppm Load Capacitance:20pF Frequency Stability:±30ppm Frequency Stability:±30ppm Equivalent Series Resistance(ESR):8; LCSC Part Name: 8MHz ±20ppm 20pF; Supplier Part: C19189930; Manufacturer: YJX(雅晶鑫); Supplier Footprint: HC-49S; JLCPCB Part Class: Extended Part; Datasheet: https://item.szlcsc.com/datasheet/T49S8MLDBE2X/20422180.html; Supplier: LCSC; Type: Through Hole Crystal Oscillator; Normal temperature Frequency Tolerance: ±20ppm; Load Capacitance: 20pF; Frequency Stability: ±30ppm; Equivalent Series Resistance(ESR): 80Ω; Operating Temperature: -20℃~+70℃
X2 = OXETDLJANF-25MHZ: Frequency:25MHz Voltage - Supply:3.3V Voltage - Supply:3.3V Frequency Stability:±25ppm Frequency Stability:±25ppm Operating Temperature:-40℃~+85℃ Operating Temperature:-40℃~+85℃; Supplier Part: C5382666; Manufacturer: TAITIEN(泰艺电子); Supplier Footprint: SMD3225-4P; JLCPCB Part Class: Extended Part; Datasheet: https://atta.szlcsc.com/upload/public/pdf/source/20240422/44B1B88876E7BE6E2B9E1240E5C74211.pdf; Supplier: LCSC; Voltage - Supply: 3.3V; Frequency Stability: ±25ppm; Operating Temperature: -40℃~+85℃

## Nets
3.3V: C50.2 C52.2 D5.2(C) D6.2(C) U18.1(VCCI) U18.8(VCCO) U20.1(VCCI) U20.8(VCCO)
3.7VBAD: C42.1 C43.1 C77.1 C78.2 C85.2 D10.1(C) L15.2 R42.2 U16.1(VIN) U16.3(EN)
+3.3V: C1.1 C3.2 C19.1 C21.2 C32MCU.1 C44.1 C48.1 D10.2(A) H1.1 L1.2 L2.2 L3.2 R44.2 R45.2 SW2.1 U1.1(VBAT) U1.19(VDD) U1.32(VDD) U1.48(VDD) U1.64(VDD) U9.3(VDD) U12.3(VDD) U12.6(A0) U16.5(VOUT) U19.8(I/O-VCC) U19.9(VCC) U19.10(A) X2.4(VDD)
+5V: C46.2 C67.2 C72.1 C74.2 C79.1 C84.2 C86.1 C99.1 C101.2 L16.2 LED1.4(VDD) LED2.4(VDD) LED3.4(VDD) LED4.4(VDD) LED5.4(VDD) LED6.4(VDD) LED7.4(VDD) LED8.4(VDD) LED9.4(VDD) LED10.4(VDD) LED11.4(VDD) LED12.4(VDD) LED13.4(VDD) LED14.4(VDD) R24.2 R38.2 U17.1(VIN) U17.6(EN) U23.4(EN) U23.5(IN) U25.8(VCC+)
+20V: C81.1 C87.1 C90.1 C91.1 C93.1 C94.1 C96.1 C97.1 F1.2 R40.1 U8.5(VIN) U11.5(VIN) U22.5(IN)
-5V: C49.2 C98.2 C100.1 R22.2 U17.4(VOUT) U25.4(VCC-)
GND: C1.2 C2.1 C3.1 C4.1 C7.1 C8.2 C9.2 C10.1 C12.1 C13.1 C14.1 C15.2 C17.1 C18.1 C19.2 C20.2 C21.1 C32MCU.2 C42.2 C43.2 C44.2 C46.1 C48.2 C49.1 C50.1 C51.2 C52.1 C53.2 C67.1 C72.2 C74.1 C77.2 C78.1 C79.2 C80.1 C81.2 C82.2 C83.2 C84.1 C85.1 C86.2 C87.2 C88.2 C90.2 C91.2 C92.1 C93.2 C94.2 C95.2 C98.1 C99.2 C100.2 C101.1 C102.2 C103.1 C104.1 D1.2(A) D2.2(A) D5.1(A) D6.1(A) D7.2(A) D8.2(A) D9.2(A) H1.2 H3.2 H4.2 H5.1 H5.3 H6.1 H6.3 H7.2 H8.2 LED1.2(GND) LED2.2(GND) LED3.2(GND) LED4.2(GND) LED5.2(GND) LED6.2(GND) LED7.2(GND) LED8.2(GND) LED9.2(GND) LED10.2(GND) LED11.2(GND) LED12.2(GND) LED13.2(GND) LED14.2(GND) Q1.2(E) R1.2 R3.1 R6.1 R11.1 R16.1 R23.1 R24.1 R25.1 R28.1 R33.1 R35.1 R39.1 R41.2 R43.1 R46.2 R47.2 SW1.C SW1.E SW2.3 U1.12(VSSA/VREF-) U1.18(VSS) U1.31(VSS) U1.47(VSS) U1.63(VSS) U2.4(DGND) U2.9(AGND) U4.4(DGND) U4.9(AGND) U7.9(CFG1) U7.11(GND) U8.1(GND) U9.2(VSS) U9.6(A0) U11.1(GND) U12.2(VSS) U16.2(GND) U17.2(GND) U17.9(PAD) U18.5(LE/HYS) U18.6(GND) U19.1(GND) U19.12(GND) U20.5(LE/HYS) U20.6(GND) U22.2(GND) U23.2(GND) USBC1.1(EH) USBC1.2(EH) USBC1.3(EH) USBC1.4(EH) USBC1.B1A12(GND) USBC2.1(EH) USBC2.2(EH) USBC2.3(EH) USBC2.4(EH) USBC2.B1A12(GND) X2.2(GND)
$1N585: C7.2 U1.5(PH0-OSC_IN) X1.2
$1N596: C2.2 U1.6(PH1-OSC_OUT) X1.1
$1N1851: H1.5 U1.7(NRST)
$1N1913: R1.1 U1.60(BOOT0)
$1N2152: C11.1 U2.1(COMP)
$1N2458: C15.1 U2.3(CAP/2.5V)
$1N3323: C12.2 R7.1 U2.10(VOUT)
$1N3614: C16.1 U4.1(COMP)
$1N3615: C16.2 C18.2 C80.2 L3.1 U4.2(VDD)
$1N3618: C20.1 U4.3(CAP/2.5V)
$1N4241: U2.5(MCLK) U4.5(MCLK) X2.3(Output)
$1N4589: R3.2 R5.1 U25.6(IN2-)
$1N4663: R4.2 U25.5(IN2+)
$1N4714: H3.1 R5.2 U25.7(OUT2)
$1N4922: R6.2 R8.1 U25.2(IN1-)
$1N5138: C11.2 C13.2 C14.2 L2.1 U2.2(VDD)
$1N5202: U1.38(PC7) U2.8(FSYNC)
$1N5230: C17.2 R4.1 U4.10(VOUT)
$1N5240: U1.21(PA5) U2.7(SCLK) U4.7(SCLK)
$1N5277: U1.37(PC6) U4.8(FSYNC)
$1N6288: C92.2 R9.2 U7.1(VDD)
$1N6894: C96.2 U8.4(VC)
$1N7290: R10.1 R11.2 R12.2 U8.2(FB)
$1N7531: R12.1 U9.1(VOUT)
$1N7563: R45.1 U1.62(PB9) U9.4(SDA) U12.4(SDA)
$1N8313: C97.2 U11.4(VC)
$1N8365: R17.1 U12.1(VOUT)
$1N14166: C47.1 U17.8(C1+)
$1N14170: C47.2 U17.7(C1-)
$1N14199: C4.2 U17.3(CPOUT)
$1N14425: R22.1 R23.2 U17.5(VFB)
$1N14703: R15.1 R16.2 R17.2 U11.2(FB)
$1N14730: U1.23(PA7) U2.6(SDATA) U4.6(SDATA)
$1N14753: R44.1 U1.61(PB8) U9.5(SCL) U12.5(SCL)
$1N18725: R25.2 R26.1 U18.2(VP)
$1N18813: C51.1 D5.3 R28.2 R29.2 U18.3(VN)
$1N21926: U1.57(PB5) U19.5(SDA)
$1N21936: U1.55(PB3) U19.4(SCL)
$1N21977: U1.29(PB10) U19.3(RS)
$1N22025: U1.33(PB12) U19.2(CS)
$1N22161: R26.2 U1.16(PA2) U18.7(Q)
$1N22287: R31.2 U1.15(PA1)
$1N22291: Q1.1(B) R31.1
$1N22318: R32.2 U19.11(K)
$1N22321: Q1.3(C) R32.1
$1N22726: R34.2 U1.17(PA3) U20.7(Q)
$1N22732: R33.2 R34.1 U20.2(VP)
$1N22733: C53.1 D6.3 R35.2 R36.2 U20.3(VN)
$1N22742: H8.1 R36.1
$1N26018: R37.1 U1.14(PA0)
$1N26022: LED1.3(DI) R37.2
$1N26280: LED1.1(DO) LED2.3(DI)
$1N26466: LED2.1(DO) LED3.3(DI)
$1N26583: LED3.1(DO) LED4.3(DI)
$1N26700: LED4.1(DO) LED5.3(DI)
$1N26817: LED5.1(DO) LED6.3(DI)
$1N26936: LED6.1(DO) LED7.3(DI)
$1N30201: LED8.1(DO) LED9.3(DI)
$1N30205: LED9.1(DO) LED10.3(DI)
$1N30209: LED10.1(DO) LED11.3(DI)
$1N30213: LED11.1(DO) LED12.3(DI)
$1N30937: LED12.1(DO) LED13.3(DI)
$1N30941: LED13.1(DO) LED14.3(DI)
$1N34226: C70.2 U22.1(BS)
$1N34610: R38.1 R39.2 U22.3(FB)
$1N34796: C70.1 L16.1 U22.6(LX)
$1N34941: R40.2 R41.1 U22.4(EN)
$1N35020: C8.1 C9.1 L1.1 U1.13(VDDA/VREF+) U1.52(PC11)
$1N39030: H1.4 U1.46(PA13)
$1N39037: H1.3 U1.49(PA14)
$1N45861: D8.1(C) U7.7(CC1) USBC1.A5(CC1)
$1N45870: D7.1(C) U7.6(CC2) USBC1.B5(CC2)
$1N47534: H7.1 R29.1
$1N51078: D9.1(C) F1.1 R9.1 U7.8(VBUS) USBC1.A4B9(VBUS)
$1N51620: C76.2 U23.1(BS)
$1N51622: R42.1 R43.2 U23.3(FB)
$1N51629: C76.1 L15.1 U23.6(LX)
$1N59316: C10.2 U1.30(VCAP1)
$1N79865: R46.1 USBC2.B5(CC2)
$1N79871: R47.1 USBC2.A5(CC1)
$1N84112: R7.2 U25.3(IN1+)
$1N88101: U1.44(PA11) USBC2.A7(DN1) USBC2.B7(DN2)
$1N88141: U1.45(PA12) USBC2.A6(DP1) USBC2.B6(DP2)
$1N102107: R15.2 R48.1
$1N102197: LED8.3(DI) R50.2
$1N102205: R50.1 U1.26(PB0)
$1N106263: R49.2 R51.1
$1N106370: R10.2 R52.1
$1N106372: R49.1 R52.2
$1N114591: C104.2 SW1.D U1.36(PB15)
$1N114599: C103.2 SW1.A U1.58(PB6)
$1N114607: C102.1 SW1.B U1.59(PB7)
$1N131496: SW2.2 U19.6(RST)
Net-(C82-1): C82.1 H5.2 R51.2 U15.1
Net-(C83-1): C83.1 H6.2 L14.1 R48.2
Net-(C88-1): C88.1 D1.1(C) U8.3(SW) U8.6(SW) U15.2
Net-(C95-1): C95.1 D2.1(C) L14.2 U11.3(SW) U11.6(SW)
Net-(H4-1): H4.1 R8.2 U25.1(OUT1)

Not connected (* = marked no-connect by the designer): LED7 1(DO); LED14 1(DO); SW1 6 7; SW2 4 5; U1 2(PC13) 3(PC14-OSC32_IN) 4(PC15-OSC32_OUT) 8(PC0) 9(PC1) 10(PC2) 11(PC3) 20(PA4) 22(PA6) 24(PC4) 25(PC5) 27(PB1) 28(PB2) 34(PB13) 35(PB14) 39(PC8) 40(PC9) 41(PA8) 42(PA9) 43(PA10) 50(PA15) 51(PC10) 53(PC12) 54(PD2) 56(PB4); U7 2(CFG2) 3(CFG3) 4(DP) 5(DM) 10(PG); U16 4(NC); U18 4(SDN); U19 7(NC); U20 4(SDN); USBC1 A1B12(GND) A6(DP1) A7(DN1) A8(SBU1) B4A9(VBUS) B6(DP2) B7(DN2) B8(SBU2); USBC2 A1B12(GND) A4B9(VBUS) A8(SBU1) B4A9(VBUS) B8(SBU2); X2 1(Tri-State)
